# EAGLE board alan2 (EAGLE 7.4.0)
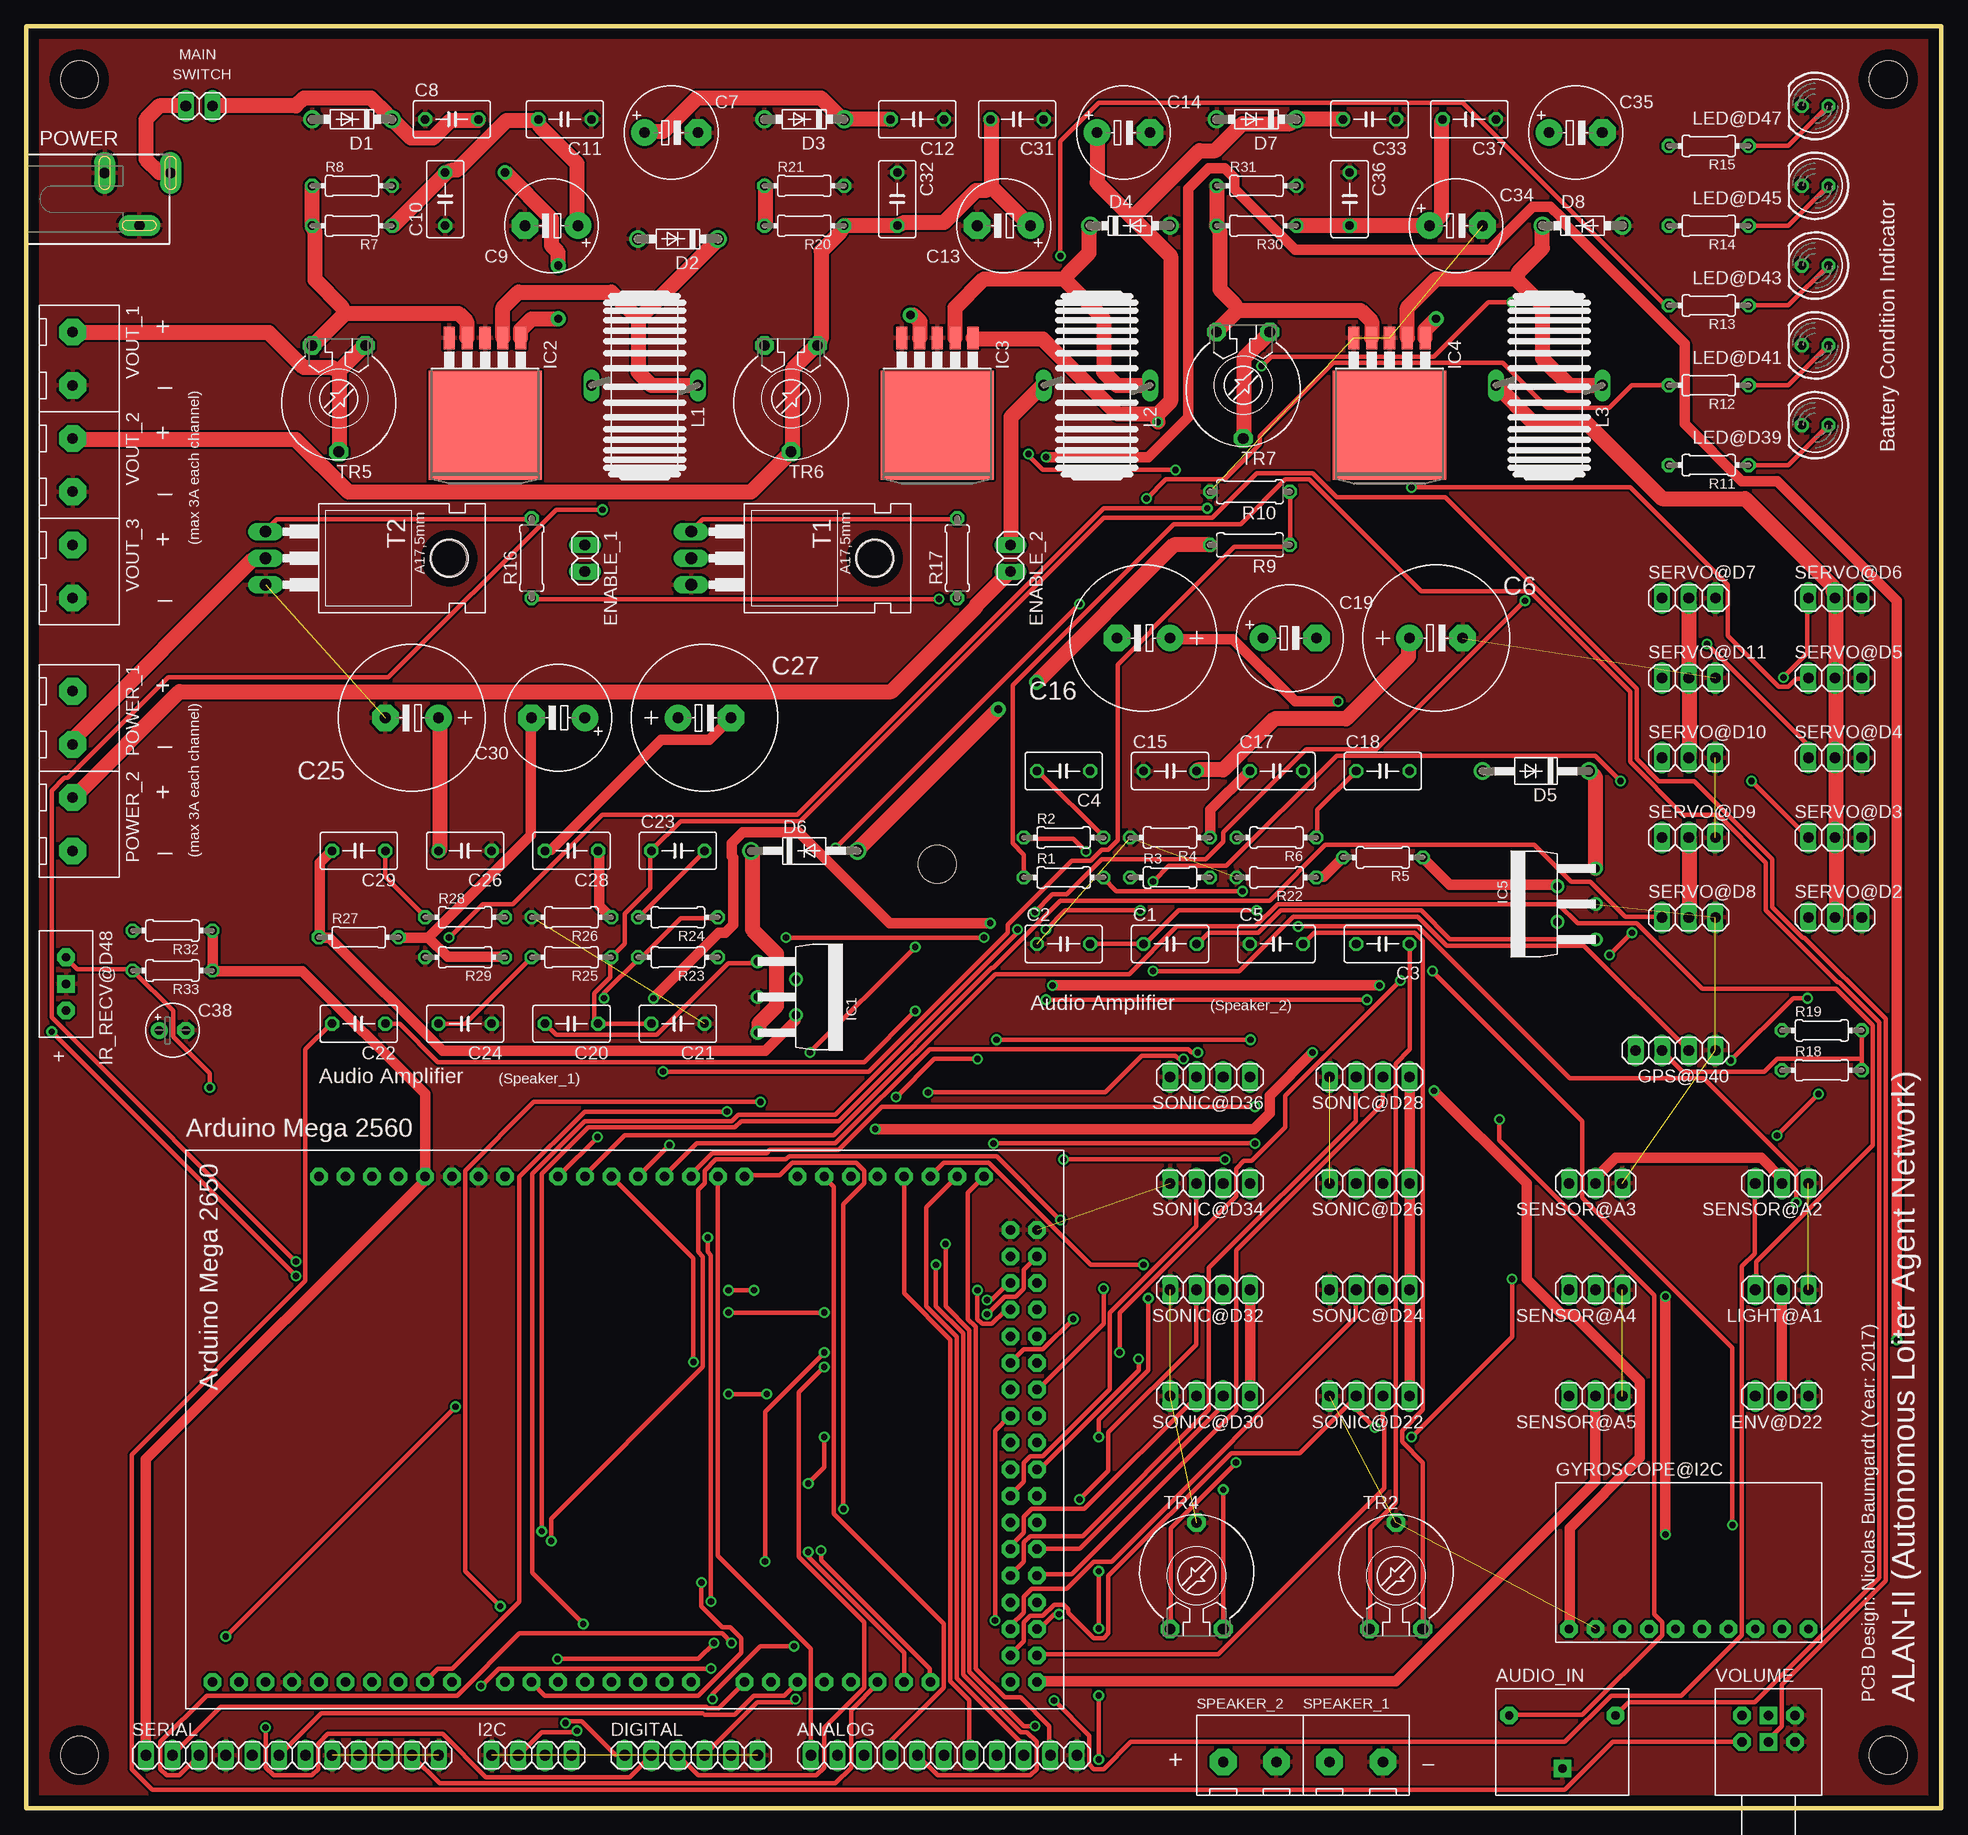
[diagram p5: board, top side]
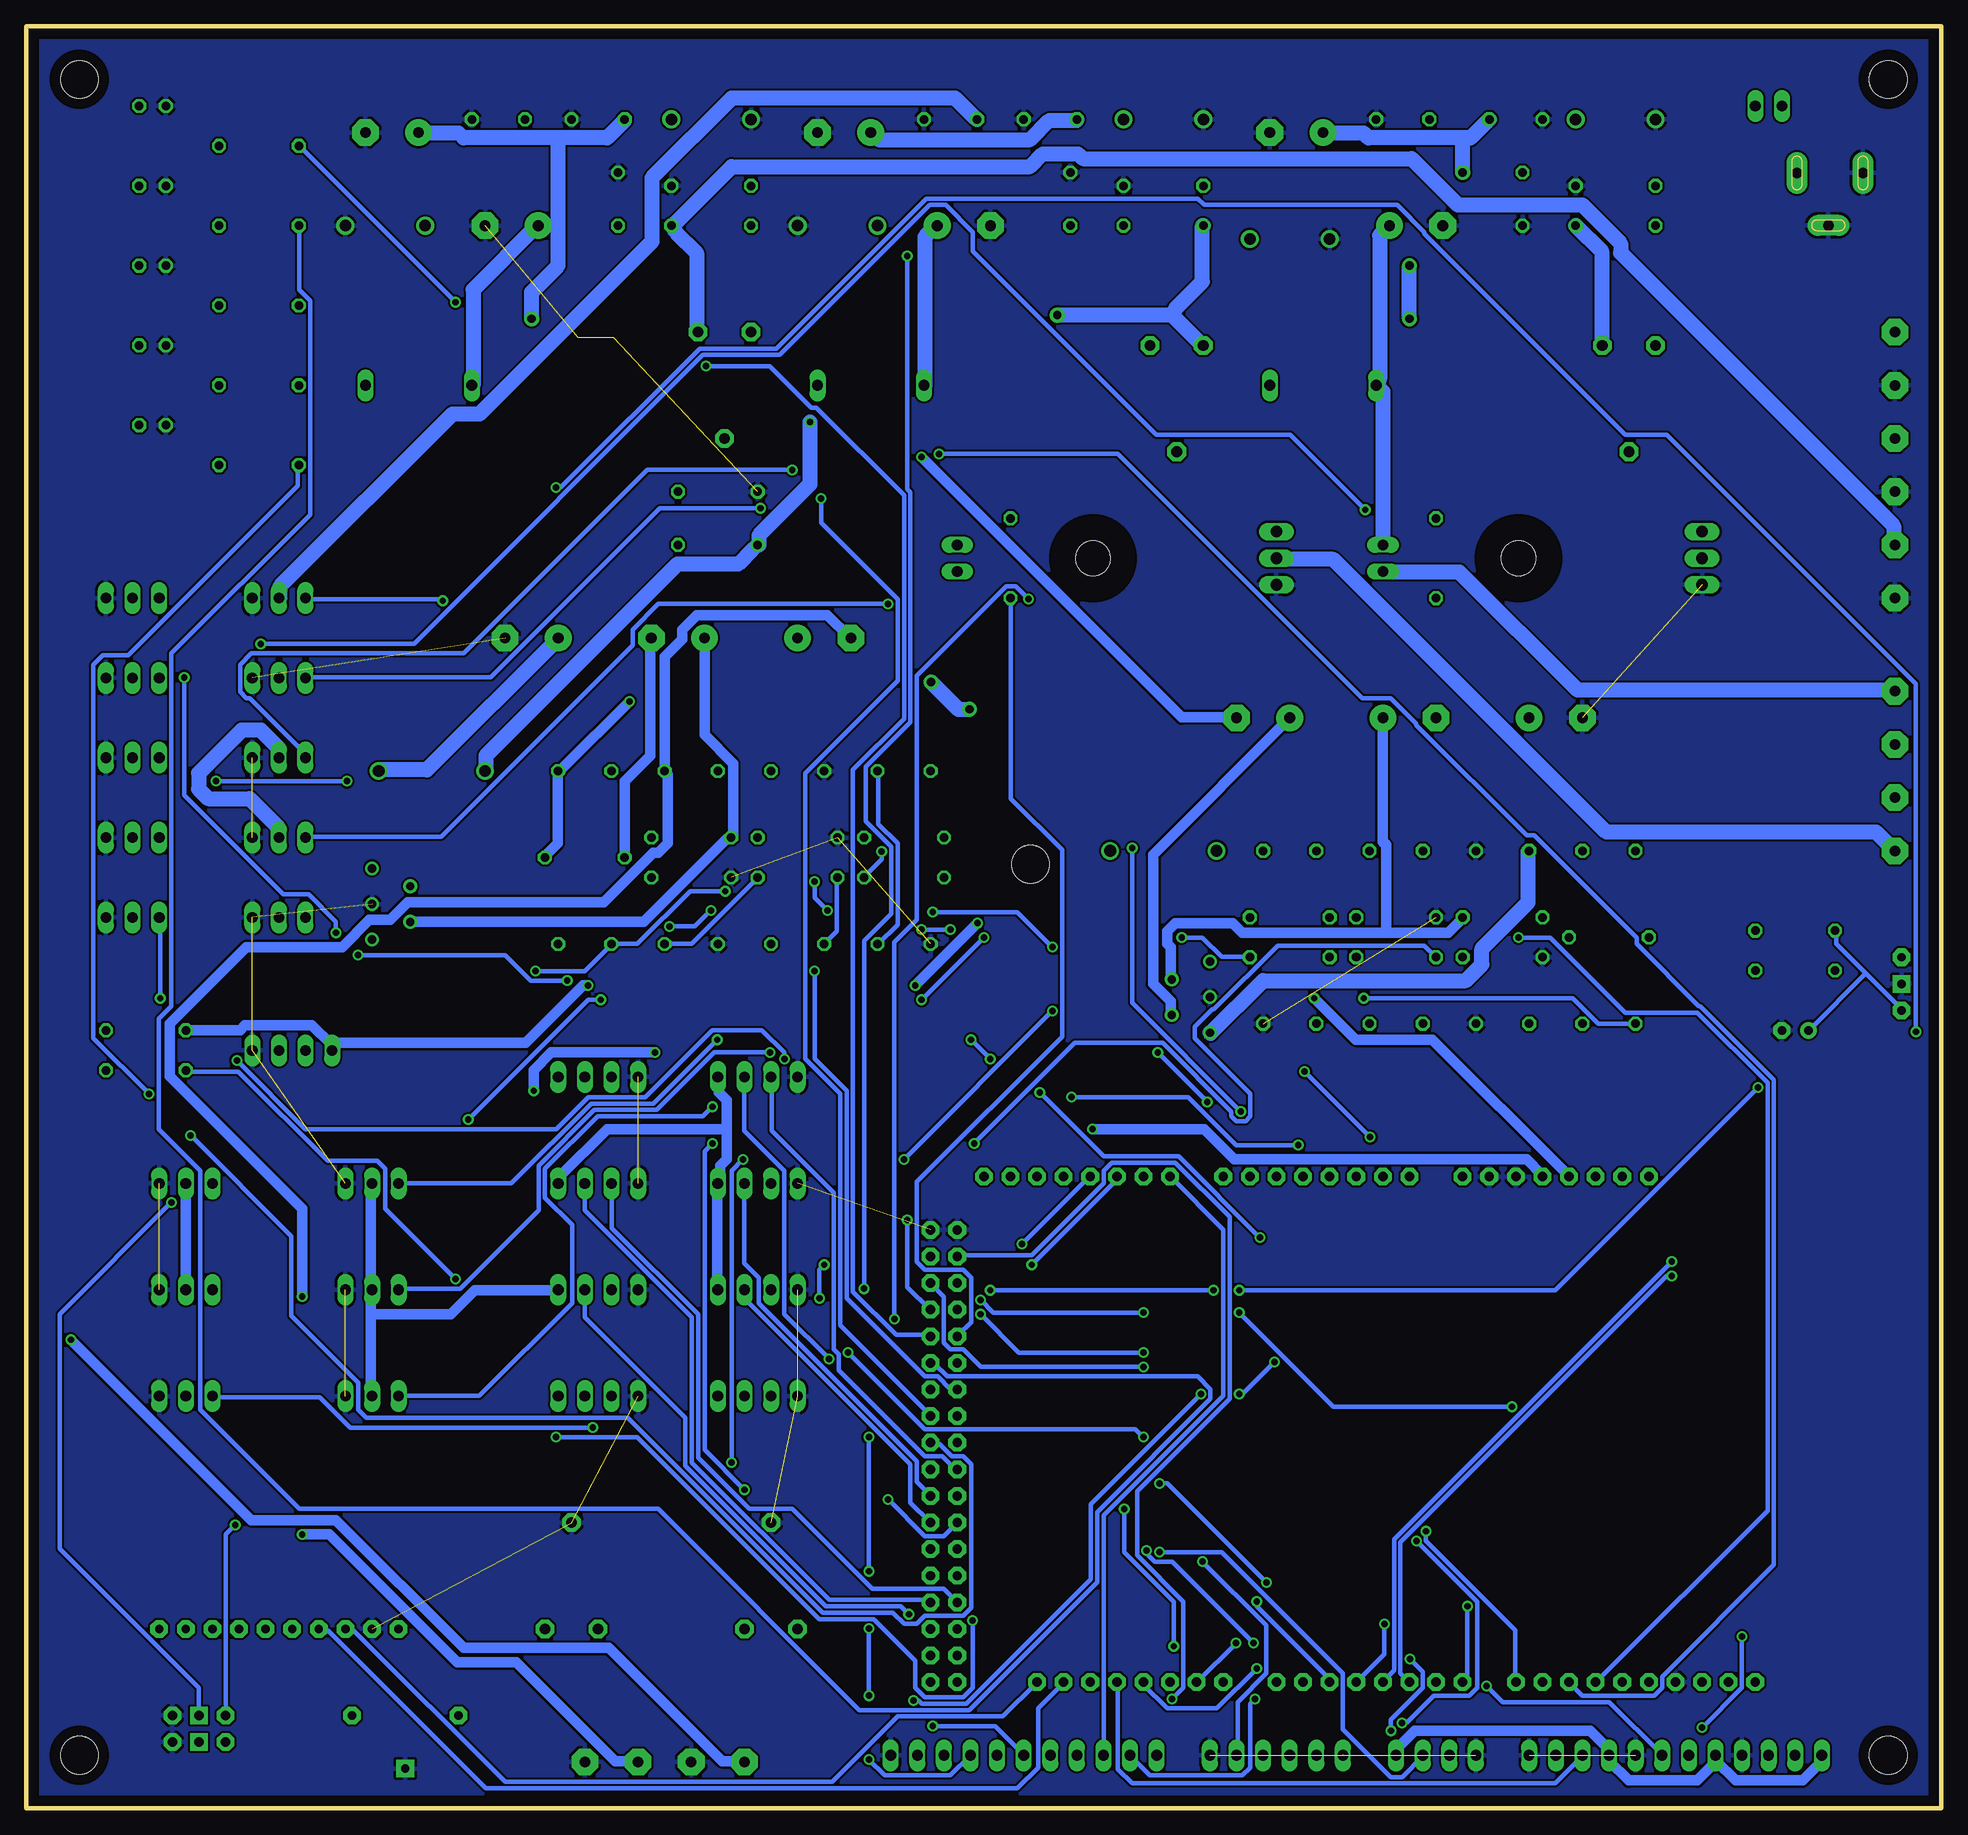
[diagram p6: board, bottom side, seen from below]

Size 182.88 x 170.18 mm. Coordinates in mm from the lower left corner, seen from the top.
Outline: 0,0 0,170.18 182.88,170.18 182.88,0 0,0
Copper layers (1*16): Top 0.035mm / dielectric 1.5mm / Bottom 0.035mm
Design rules "default": minimum track width 10mil, minimum drill 24mil, track to track 8mil, track to pad 8mil, pad to pad 8mil, via to via 8mil, smd to smd 8mil, copper to edge 40mil, drill to drill 8mil, minimum pad ring 10mil, minimum via ring 8mil, stop-mask expansion 4mil, vias tented up to drill 0mil, thermal gap 10mil
Net classes: 0 default: width 0.406 mm, clearance 0.203 mm; 1 lo_power: width 1.016 mm, clearance 0.305 mm; 2 hi_pow: width 1.422 mm, clearance 0.406 mm
Holes 3.6 mm at 5.08,165.1 5.08,5.08 177.8,165.1 177.8,5.08 87,90.17

## Footprints (pad centres in the part's own frame; a part is rotated, then mirrored left to right if it is on the bottom)
1X11 = drill 1.016 long: 1 -12.7,0; 2 -10.16,0; 3 -7.62,0; 4 -5.08,0; 5 -2.54,0; 6 0,0; 7 2.54,0; 8 5.08,0; 9 7.62,0; 10 10.16,0; 11 12.7,0
ARDUINO_MEGA_PINOUT = drill 0.9 pad 1.676 octagon: +3.3V -25.4,-21.59; +5V0 -25.4,-19.05; +5V1 22.86,36.83; +5V2 22.86,39.37; A0 -25.4,-6.35; A1 -25.4,-3.81; A2 -25.4,-1.27; A3 -25.4,1.27; A4 -25.4,3.81; A5 -25.4,6.35; A6 -25.4,8.89; A7 -25.4,11.43; A8 -25.4,16.51; A9 -25.4,19.05; A10 -25.4,21.59; A11 -25.4,24.13; A12 -25.4,26.67; A13 -25.4,29.21; A14 -25.4,31.75; A15 -25.4,34.29; AREF 22.86,-34.29; D2 22.86,1.27; D3 22.86,-1.27; D4 22.86,-3.81; D5 22.86,-6.35; D6 22.86,-8.89; D7 22.86,-11.43; D8 22.86,-16.51; D9 22.86,-19.05; D10 22.86,-21.59; D11 22.86,-24.13; D12 22.86,-26.67; D13 22.86,-29.21; D22 20.32,36.83; D23 20.32,39.37; D24 17.78,36.83; D25 17.78,39.37; D26 15.24,36.83; D27 15.24,39.37; D28 12.7,36.83; D29 12.7,39.37; D30 10.16,36.83; D31 10.16,39.37; D32 7.62,36.83; D33 7.62,39.37; D34 5.08,36.83; D35 5.08,39.37; D36 2.54,36.83; D37 2.54,39.37; D38 0,36.83; D39 0,39.37; D40 -2.54,36.83; D41 -2.54,39.37; D42 -5.08,36.83; D43 -5.08,39.37; D44 -7.62,36.83; D45 -7.62,39.37; D46 -10.16,36.83; D47 -10.16,39.37; D48 -12.7,36.83; D49 -12.7,39.37; D50 -15.24,36.83; D51 -15.24,39.37; D52 -17.78,36.83; D53 -17.78,39.37; GND0 22.86,-31.75; GND1 -25.4,-13.97; GND2 -25.4,-16.51; GND3 -20.32,36.83; GND4 -20.32,39.37; IOREF -25.4,-26.67; N/A -25.4,-29.21; RESET -25.4,-24.13; RX0 22.86,6.35; RX1 22.86,24.13; RX2 22.86,19.05; RX3 22.86,13.97; SCL0 22.86,-39.37; SCL1 22.86,29.21; SDA0 22.86,-36.83; SDA1 22.86,26.67; TX0 22.86,3.81; TX1 22.86,21.59; TX2 22.86,16.51; TX3 22.86,11.43; VIN -25.4,-11.43
AUDIOJACK = drill 0.8 pad 1.676 square: GND 0,2.54 | drill 0.8 pad 1.676 octagon: LEFT -5.08,-2.54; RIGHT 5.08,-2.54
C050-035X075 = drill 0.813 octagon: 1 -2.54,0; 2 2.54,0
E5-13 = drill 1.016 pad 2.54: + -2.54,0 | drill 1.016 pad 2.54 octagon: - 2.54,0
E5-8,5 = drill 1.016 pad 2.54: + -2.54,0 | drill 1.016 pad 2.54 octagon: - 2.54,0
E5-10,5 = drill 1.016 pad 2.54: + -2.54,0 | drill 1.016 pad 2.54 octagon: - 2.54,0
E2,5-5 = drill 0.813 pad 1.6: + -1.27,0 | drill 0.813 pad 1.6 octagon: - 1.27,0
DO41-7.6 = drill 1.1 pad 1.7: A 3.81,0; C -3.81,0
DO41-10 = drill 1.118: A 5.08,0; C -5.08,0
1X06 = drill 1.016 long: 1 -6.35,0; 2 -3.81,0; 3 -1.27,0; 4 1.27,0; 5 3.81,0; 6 6.35,0
1X02 = drill 1.016 long: 1 -1.27,0; 2 1.27,0
1X03 = drill 1.016 long: 1 -2.54,0; 2 0,0; 3 2.54,0
1X04 = drill 1.016 long: 1 -3.81,0; 2 -1.27,0; 3 1.27,0; 4 3.81,0
GYROSCOPE = drill 0.8 pad 1.676 octagon: ADO 7.62,0; ECL 10.16,0; EDA 12.7,0; FSYNC 0,0; GND 20.32,0; INT 5.08,0; NCS 2.54,0; SCL 17.78,0; SDA 15.24,0; VCC 22.86,0
PENTAWATT-V = drill 0.8: 1 -3.4,-3.81; 2 -1.7,-0.16; 3 0,-3.81; 4 1.7,-0.16; 5 3.4,-3.81
TO263-5 = smd 1.067 x 2.159: 1 -3.404,-5.791; 2 -1.702,-5.791; 3 0,-5.791; 4 1.702,-5.791; 5 3.404,-5.791 | smd 10.8 x 10.41: 6 0,2.54
TSOP1838 = drill 0.8 pad 1.676 square: GND 0,0 | drill 0.8 pad 1.676 octagon: SIG -2.54,0; VCC 2.54,0
SFT830D = drill 1.016 long: 1 -5.08,0; 2 5.08,0
LED5MM = drill 0.813 octagon: A -1.27,0; K 1.27,0
SCD-014-A = drill 1 pad 2 long: 1 -2.5,13.8; 2 -2.5,7.5; 3 2.5,10.8
TERMINAL_BLOCK = drill 1 pad 2.54 octagon: A 2.54,3.175; B 7.62,3.175
0204/7 = drill 0.813 octagon: 1 -3.81,0; 2 3.81,0
0207/7 = drill 0.813 octagon: 1 -3.81,0; 2 3.81,0
1X12 = drill 1.016 long: 1 -13.97,0; 2 -11.43,0; 3 -8.89,0; 4 -6.35,0; 5 -3.81,0; 6 -1.27,0; 7 1.27,0; 8 3.81,0; 9 6.35,0; 10 8.89,0; 11 11.43,0; 12 13.97,0
TO220 = drill 1.118 long: 1 -2.54,-6.35; 2 0,-6.35; 3 2.54,-6.35 | hole 3.302: 0,11.176
PT-10 = drill 1.016 pad 1.778 octagon: 1 -2.54,-5.08; 2 2.54,-5.08; 3 0,5.08
POTI_STEREO = drill 0.9 pad 1.676 octagon: LA 2.54,5.08; LB 7.62,5.08; RA 2.54,2.54; RB 7.62,2.54 | drill 0.9 pad 1.676 square: LC 5.08,5.08; RC 5.08,2.54

## Placement (x,y rotation side)
ANALOG  [1X11]  87.63,5.08 0 top
ATMEGA  ARDUINO_MEGA_PINOUT  [ARDUINO_MEGA_PINOUT]  57.15,34.92 270 top
AUDIO_IN  AUDIOJACK  [AUDIOJACK]  146.69,6.35 180 top
C1  220nF  [C050-035X075]  109.22,82.55 0 top
C2  2.2nF  [C050-035X075]  99.06,82.55 0 top
C3  47nF  [C050-035X075]  129.54,82.55 180 top
C4  22nF  [C050-035X075]  99.06,99.06 180 top
C5  150nF  [C050-035X075]  119.38,82.55 0 top
C6  1000uF  [E5-13]  134.62,111.76 0 top
C7  220uF  [E5-8,5]  61.59,160.02 0 top
C8  10uF  [C050-035X075]  40.64,161.29 0 top
C9  220uF  [E5-8,5]  50.16,151.13 180 top
C10  10uF  [C050-035X075]  40.01,153.67 90 top
C11  10uF  [C050-035X075]  51.44,161.29 180 top
C12  10uF  [C050-035X075]  85.09,161.29 180 top
C13  220uF  [E5-8,5]  93.34,151.13 180 top
C14  220uF  [E5-8,5]  104.78,160.02 0 top
C15  100nF  [C050-035X075]  109.22,99.06 0 top
C16  1000uF  [E5-13]  106.68,111.76 180 top
C17  100nF  [C050-035X075]  119.38,99.06 0 top
C18  33nF  [C050-035X075]  129.54,99.06 0 top
C19  470uF  [E5-10,5]  120.65,111.76 0 top
C20  220nF  [C050-035X075]  52.07,74.93 180 top
C21  2.2nF  [C050-035X075]  62.23,74.93 180 top
C22  47nF  [C050-035X075]  31.75,74.93 180 top
C23  22nF  [C050-035X075]  62.23,91.44 0 top
C24  150nF  [C050-035X075]  41.91,74.93 180 top
C25  1000uF  [E5-13]  36.83,104.14 180 top
C26  100nF  [C050-035X075]  41.91,91.44 180 top
C27  1000uF  [E5-13]  64.77,104.14 0 top
C28  100nF  [C050-035X075]  52.07,91.44 180 top
C29  33nF  [C050-035X075]  31.75,91.44 180 top
C30  470uF  [E5-10,5]  50.8,104.14 180 top
C31  10uF  [C050-035X075]  94.61,161.29 180 top
C32  10uF  [C050-035X075]  83.19,153.67 270 top
C33  10uF  [C050-035X075]  128.27,161.29 180 top
C34  220uF  [E5-8,5]  136.53,151.13 0 top
C35  220uF  [E5-8,5]  147.96,160.02 0 top
C36  10uF  [C050-035X075]  126.36,153.67 270 top
C37  10uF  [C050-035X075]  137.79,161.29 180 top
C38  100uF  [E2,5-5]  13.97,74.3 0 top
D1  UF4004  [DO41-7.6]  31.11,161.29 180 top
D2  SR504  [DO41-7.6]  62.23,149.86 180 top
D3  UF4004  [DO41-7.6]  74.3,161.29 180 top
D4  SR504  [DO41-7.6]  105.41,151.13 0 top
D5  1N4936  [DO41-10]  144.15,99.06 180 top
D6  1N4936  [DO41-10]  74.3,91.44 0 top
D7  UF4004  [DO41-7.6]  117.47,161.29 180 top
D8  SR504  [DO41-7.6]  148.59,151.13 0 top
DIGITAL  [1X06]  63.5,5.08 0 top
ENABLE_1  [1X02]  53.34,119.38 270 top
ENABLE_2  [1X02]  93.98,119.38 270 top
ENV@D22  [1X03]  167.64,39.37 180 top
GPS@D40  [1X04]  157.48,72.39 180 top
GYROSCOPE@I2C  GYROSCOPE  [GYROSCOPE]  170.18,17.14 180 top
I2C  [1X04]  48.26,5.08 0 top
IC1  TDA2003  [PENTAWATT-V]  73.66,77.47 270 top
IC2  LM2596S  [TO263-5]  43.81,134.62 180 top
IC3  LM2596S  [TO263-5]  87,134.62 180 top
IC4  LM2596S  [TO263-5]  130.18,134.62 180 top
IC5  TDA2003  [PENTAWATT-V]  146.05,86.36 90 top
IR_RECV@D48  TSOP1838  [TSOP1838]  3.81,78.74 270 top
L1  33uH  [SFT830D]  59.05,135.89 180 top
L2  33uH  [SFT830D]  102.23,135.89 180 top
L3  33uH  [SFT830D]  145.41,135.89 180 top
LED@D39  [LED5MM]  170.81,132.08 180 top
LED@D41  [LED5MM]  170.81,139.7 180 top
LED@D43  [LED5MM]  170.81,147.32 180 top
LED@D45  [LED5MM]  170.81,154.94 180 top
LED@D47  [LED5MM]  170.81,162.56 180 top
LIGHT@A1  [1X03]  167.64,49.53 180 top
MAINSWITCH  [1X02]  16.51,162.56 180 top
POWER  12V / 9A  [SCD-014-A]  0,153.67 270 top
POWER_1  TERMINAL_BLOCK  [TERMINAL_BLOCK]  1.27,109.22 270 top
POWER_2  TERMINAL_BLOCK  [TERMINAL_BLOCK]  1.27,99.06 270 top
R1  5K6?  [0204/7]  99.06,88.9 0 top
R2  47K  [0204/7]  99.06,92.71 0 top
R3  2.7K  [0204/7]  109.22,88.9 0 top
R4  1R  [0204/7]  109.22,92.71 180 top
R5  220R  [0204/7]  129.54,90.81 180 top
R6  39R  [0204/7]  119.38,92.71 180 top
R7  ?  [0204/7]  31.11,151.13 180 top
R8  470R  [0204/7]  31.11,154.94 0 top
R9  1M  [0207/7]  116.84,120.65 180 top
R10  390K  [0207/7]  116.84,125.73 180 top
R11  220R  [0204/7]  160.66,128.27 180 top
R12  220R  [0204/7]  160.66,135.89 180 top
R13  220R  [0204/7]  160.66,143.51 180 top
R14  220R  [0204/7]  160.66,151.13 180 top
R15  220R  [0204/7]  160.66,158.75 180 top
R16  2K2  [0207/7]  48.26,119.38 90 top
R17  2K2  [0207/7]  88.9,119.38 90 top
R18  4K7  [0204/7]  171.45,70.48 0 top
R19  10K  [0204/7]  171.45,74.3 0 top
R20  ?  [0204/7]  74.3,151.13 180 top
R21  470R  [0204/7]  74.3,154.94 0 top
R22  2R2  [0204/7]  119.38,88.9 180 top
R23  5K6?  [0204/7]  62.23,81.28 180 top
R24  47K  [0204/7]  62.23,85.09 180 top
R25  2.7K  [0204/7]  52.07,81.28 180 top
R26  1R  [0204/7]  52.07,85.09 180 top
R27  220R  [0204/7]  31.75,83.19 0 top
R28  39R  [0204/7]  41.91,85.09 0 top
R29  2R2  [0204/7]  41.91,81.28 180 top
R30  ?  [0204/7]  117.47,151.13 180 top
R31  470R  [0204/7]  117.47,154.94 0 top
R32  100R  [0204/7]  13.97,83.82 180 top
R33  20K  [0204/7]  13.97,80.01 180 top
SENSOR@A2  [1X03]  167.64,59.69 180 top
SENSOR@A3  [1X03]  149.86,59.69 180 top
SENSOR@A4  [1X03]  149.86,49.53 180 top
SENSOR@A5  [1X03]  149.86,39.37 180 top
SERIAL  [1X12]  25.4,5.08 180 top
SERVO@D2  [1X03]  172.72,85.09 0 top
SERVO@D3  [1X03]  172.72,92.71 0 top
SERVO@D4  [1X03]  172.72,100.33 0 top
SERVO@D5  [1X03]  172.72,107.95 0 top
SERVO@D6  [1X03]  172.72,115.57 0 top
SERVO@D7  [1X03]  158.75,115.57 0 top
SERVO@D8  [1X03]  158.75,85.09 0 top
SERVO@D9  [1X03]  158.75,92.71 0 top
SERVO@D10  [1X03]  158.75,100.33 0 top
SERVO@D11  [1X03]  158.75,107.95 0 top
SONIC@D22  [1X04]  128.27,39.37 180 top
SONIC@D24  [1X04]  128.27,49.53 180 top
SONIC@D26  [1X04]  128.27,59.69 180 top
SONIC@D28  [1X04]  128.27,69.85 180 top
SONIC@D30  [1X04]  113.03,39.37 180 top
SONIC@D32  [1X04]  113.03,49.53 180 top
SONIC@D34  [1X04]  113.03,59.69 180 top
SONIC@D36  [1X04]  113.03,69.85 180 top
SPEAKER_1  TERMINAL_BLOCK  [TERMINAL_BLOCK]  121.92,1.27 0 top
SPEAKER_2  TERMINAL_BLOCK  [TERMINAL_BLOCK]  111.76,1.27 0 top
T1  BD239  [TO220]  69.85,119.38 270 top
T2  BD239  [TO220]  29.21,119.38 270 top
TR2  100K  [PT-10]  130.81,22.22 0 top
TR4  100K  [PT-10]  111.76,22.22 0 top
TR5  10K  [PT-10]  29.84,134.62 180 top
TR6  10K  [PT-10]  73.03,134.62 180 top
TR7  10K  [PT-10]  116.2,135.89 180 top
U$2  POTI_STEREO  [POTI_STEREO]  171.45,11.43 180 top
VOUT_1  TERMINAL_BLOCK  [TERMINAL_BLOCK]  1.27,143.51 270 top
VOUT_2  TERMINAL_BLOCK  [TERMINAL_BLOCK]  1.27,133.35 270 top
VOUT_3  TERMINAL_BLOCK  [TERMINAL_BLOCK]  1.27,123.19 270 top

## Tracks (layer width: path | path; a pad name or v marks a point on that pad's centre or on a via)
+3.3V  (via drill 0.61)
  Top 1.016: v59.89,77.37 66.14,83.62 66.75,83.62 67.51,84.38 67.51,90.78 67.36,90.93 67.36,92.15 68.43,93.22 73.76,93.22 82.45,84.53 v92.05,84.53 | v129.24,78.59 v97.99,78.59
  Bottom 1.016: R19.1 167.64,74.32 162.46,74.32 162,74.78 155.6,74.78 153.77,72.95 153.77,72.49 GPS@D40.4 153.31,73.1 135.18,73.1 129.69,78.59 v129.24,78.59 | v59.89,77.37 55.93,73.41 48.62,73.41 35.66,60.45 ATMEGA.+3.3V | v97.99,78.59 v92.05,84.53
+5V0  (via drill 0.61)
  Top 1.016: R32.1 17.83,83.77 17.83,80.11 R33.1 18.29,79.96 26.36,79.96 38.1,68.22 ATMEGA.+5V0 37.95,59.84 11.43,33.33 SERIAL.12 | v134.42,68.53 143.26,59.69 143.26,50.55 146.61,47.19 147.68,47.19 154.08,40.79 154.08,33.48 147.37,26.77 147.37,17.17 GYROSCOPE@I2C.VCC | v122.83,72.19 118.72,68.07 118.72,66.4 117.2,64.87 v81.08,64.87
  Bottom 1.016: SERIAL.12 11.43,4.52 13.26,2.69 19.66,2.69 21.49,4.52 21.49,4.98 SERIAL.8 21.79,4.22 23.32,2.69 29.87,2.69 31.7,4.52 31.7,4.98 SERIAL.4 31.7,5.59 33.53,7.42 50.29,7.42 51.97,5.74 51.97,5.13 I2C.4 | v134.42,68.53 134.42,70.51 132.74,72.19 v122.83,72.19 | v81.08,64.87 70.41,64.87 67.51,61.98 39.62,61.98 38.1,60.45 ATMEGA.+5V0
+5V2
  Top 1.016: SONIC@D30.1 116.89,39.42 116.89,49.48 SONIC@D32.1 | SONIC@D22.1 132.13,39.42 132.13,49.48 SONIC@D24.1 132.13,49.94 132.13,59.69 SONIC@D26.1 132.13,60.15 132.13,69.75 SONIC@D28.1 | LIGHT@A1.2 ENV@D22.2 | ATMEGA.+5V2 96.62,12.14 130.76,12.14 149.81,31.19 149.81,39.27 SENSOR@A5.2 | SENSOR@A2.2 167.64,60.15 165.66,62.13 151.79,62.13 149.96,60.3 149.96,59.69 SENSOR@A3.2
  Bottom 1.016: SONIC@D32.1 116.89,49.63 116.89,59.69 SONIC@D34.1 116.59,60.15 116.59,61.37 115.98,61.98 115.98,64.87 | 115.98,64.87 115.98,67.62 116.74,68.38 116.74,69.75 SONIC@D36.1 | 115.98,64.87 127.41,64.87 131.98,60.3 131.98,59.69 SONIC@D26.1 | LIGHT@A1.2 SENSOR@A2.2 | 149.96,47.19 149.96,49.48 SENSOR@A4.2 149.96,49.94 149.96,59.69 SENSOR@A3.2 | 149.96,47.19 149.96,39.42 SENSOR@A5.2 | 149.96,47.19 142.34,47.19 140.06,49.48 132.13,49.48 SONIC@D24.1
+12V  (via drill 0.61, 0.8 pad 1.42)
  Top 1.422: C8.2 43.13,161.19 40.54,161.19 38.86,159.51 36.73,159.51 35.05,161.19 D1.C 34.44,161.8 32.92,163.32 26.52,163.32 25.76,162.56 MAINSWITCH.1 | C33.2 125.73,161.34 121.31,161.34 D7.C 120.7,160.88 116.13,160.88 113.54,158.29 112.01,158.29 105.61,151.89 | C12.2 82.45,161.34 78.18,161.34 D3.C 77.57,161.65 75.89,163.32 64.01,163.32 60.81,160.12 59.13,160.12 C7.+ | 108.05,133.15 104.24,133.15 97.08,140.31 90.53,140.31 IC3.1 | 108.05,133.15 109.27,134.37 109.27,148.23 105.61,151.89 | 105.61,151.89 102.26,155.25 102.26,159.97 C14.+ | v108.05,132.38 108.05,133.15 | v92.81,104.95 79.4,91.54 D6.A | v96.47,107.54 109.58,120.65 R9.2 | IC2.1 47.22,141.2 48.26,142.24 v50.8,142.24 | v50.8,147.32 50.8,148.59 50.16,149.22 50.16,151.76 v45.72,156.21 | IC4.1 133.58,141.2 v134.62,142.24
  Bottom 1.422: 45.72,159.51 44.96,159.51 C8.2 | 45.72,159.51 54.71,159.51 55.17,159.97 58.98,159.97 C7.+ | v108.05,132.38 108.05,126.44 112.93,121.56 112.93,120.65 R9.2 113.54,120.19 114.91,118.82 120.7,118.82 138.99,100.53 138.99,99.16 D5.A | v92.81,104.95 93.88,104.95 v96.47,107.54 | C12.2 82.6,161.19 85.19,161.19 87.02,159.36 101.5,159.36 102.11,159.97 C14.+ | 132.08,159.51 127.41,159.51 125.73,161.19 C33.2 | 132.08,159.51 141.12,159.51 141.58,159.97 145.39,159.97 C35.+ | v50.8,142.24 v50.8,147.32 | v45.72,156.21 45.72,159.51 | v134.62,142.24 134.62,144.78 132.08,147.32 132.08,159.51
A0  (via drill 0.61)
  Top 0.406: R10.1 120.7,125.68 120.7,120.65 R9.1 120.55,120.5 115.37,120.5 107.44,112.57 107.44,112.42 104.24,109.22 104.24,92.46 103.33,91.54 102.72,91.54 101.65,90.48 99.82,90.48 93.73,84.38 93.73,83.62 80.47,70.36 v60.81,70.36 | v54.56,64.11 50.9,60.45 ATMEGA.A0
  Bottom 0.406: v60.81,70.36 v54.56,64.11
A1
  Top 0.406: LIGHT@A1.3 165.2,49.63 165.2,52.22 176.33,63.35 176.33,74.78 172.82,78.28 160.02,78.28 153.77,84.53 148.13,84.53 146.3,86.36 119.48,86.36 117.35,84.23 109.88,84.23 105.31,79.65 92.51,79.65 77.11,64.26 57.15,64.26 53.34,60.45 ATMEGA.A1
A2  (via drill 0.61)
  Top 0.406: v98.15,10.31 101.5,6.96 101.5,4.22 101.96,3.76 102.87,3.76 105.46,6.35 146.91,6.35 151.33,10.77 158.04,10.77 163.83,16.56 163.83,51.77 165.05,52.98 165.05,59.69 SENSOR@A2.3 | v67.06,39.57 v70.71,39.57 | v63.7,42.62 63.7,52.53 55.93,60.3 ATMEGA.A2
  Bottom 0.406: v98.15,10.31 97.69,10.31 97.38,10.01 93.12,10.01 81.23,21.89 81.23,29.06 v70.71,39.57 | v67.06,39.57 66.75,39.57 v63.7,42.62
A3  (via drill 0.61)
  Top 0.406: v92.66,73.41 v116.89,73.41 | v90.83,71.58 86.72,71.58 v83.06,67.92 | v61.42,63.35 58.52,60.45 ATMEGA.A3
  Bottom 0.406: SENSOR@A3.3 136.55,59.69 128.93,67.31 122.99,67.31 v116.89,73.41 | v90.83,71.58 v92.66,73.41 | v83.06,67.92 71.93,67.92 67.36,63.35 v61.42,63.35
A4  (via drill 0.61)
  Top 0.406: v111.86,72.19 111.25,72.19 110.95,72.49 86.26,72.49 77.27,63.5 64.01,63.5 60.96,60.45 ATMEGA.A4
  Bottom 0.406: v111.86,72.19 117.2,72.19 122.68,66.7 128.63,66.7 133.96,61.37 133.96,57.1 141.43,49.63 147.22,49.63 SENSOR@A4.3
A5  (via drill 0.61)
  Top 0.406: v117.35,67.01 81.69,67.01 77.57,62.89 71.02,62.89 70.71,62.59 65.53,62.59 63.4,60.45 ATMEGA.A5
  Bottom 0.406: v117.35,67.01 118.26,66.09 128.32,66.09 133.35,61.06 133.35,58.32 130.76,55.73 130.76,48.26 139.6,39.42 147.22,39.42 SENSOR@A5.3
A6
  Top 0.406: ATMEGA.A6 66.04,24.13 74.93,15.24 ANALOG.1
A7  (via drill 0.61)
  Top 0.406: v65.53,10.46 65.53,10.92 70.1,15.49 v73.3,15.49 | v78.03,28.6 78.03,57.71 80.01,59.69 80.01,60.91 79.25,61.67 73.15,61.67 71.93,60.45 68.58,60.45 ATMEGA.A7
  Bottom 0.406: v65.53,10.46 65.99,10.01 65.99,3.91 66.75,3.15 75.59,3.15 77.42,4.98 ANALOG.2 | v73.3,15.49 73.3,19.76 78.03,24.49 v78.03,28.6
A8
  Bottom 0.406: ANALOG.3 80.01,27.99 68.58,39.42 68.58,55.27 73.61,60.3 ATMEGA.A8
A9
  Top 0.406: ANALOG.4 82.6,5.13 82.6,6.5 87.63,11.53 87.63,17.63 77.11,28.14 77.11,59.38 76.2,60.3 ATMEGA.A9
A10  (via drill 0.61)
  Top 0.406: ANALOG.5 87.02,3.15 95.86,3.15 96.47,3.76 96.47,6.35 95.56,7.26 94.94,7.26 89.46,12.75 89.46,45.36 86.87,47.95 v86.87,51.92
  Bottom 0.406: v86.87,51.92 78.79,59.99 78.79,60.3 ATMEGA.A10
A11  (via drill 0.61)
  Top 0.406: v96.32,7.87 95.25,7.87 90.07,13.06 90.07,45.67 87.78,47.95 v87.78,53.9
  Bottom 0.406: v96.32,7.87 90.37,7.87 87.63,5.13 ANALOG.6 | v87.78,53.9 81.38,60.3 ATMEGA.A11
A12
  Top 0.406: ATMEGA.A12 83.82,49.17 88.24,44.76 88.24,12.14 90.07,10.31 90.07,5.13 ANALOG.7
A13  (via drill 0.61)
  Top 0.406: v102.41,10.77 v102.41,4.67 | v102.41,22.66 v102.41,17.17 | v102.41,35.46 102.41,37.13 107.14,41.86 v107.14,48.72 | v106.68,51.92 101.65,51.92 91.9,61.67 87.63,61.67 86.41,60.45 ATMEGA.A13
  Bottom 0.406: ANALOG.8 94.64,3.15 100.89,3.15 v102.41,4.67 | v102.41,17.17 v102.41,10.77 | v102.41,35.46 v102.41,22.66 | v107.14,48.72 107.14,51.46 v106.68,51.92
A14
  Top 0.406: ANALOG.9 95.25,6.04 88.85,12.45 88.85,45.06 85.95,47.95 85.95,57.4 88.85,60.3 ATMEGA.A14
A15
  Top 0.406: ANALOG.10 97.69,5.13 97.69,7.87 94.94,10.62 93.42,10.62 90.68,13.36 90.68,45.97 89.92,46.74 89.92,58.78 91.44,60.3 ATMEGA.A15
D2  (via drill 0.61)
  Top 0.406: v170.08,77.37 168.71,77.37 v162.76,71.43 | v110.49,71.58 110.03,71.58 109.73,71.88 106.53,71.88 103.02,68.38 v86.11,68.38 | v65.08,54.51 65.08,53.14 65.38,52.83 v65.38,19.76
  Bottom 0.406: v170.08,77.37 170.08,84.99 SERVO@D2.1 | v162.76,71.43 156.21,64.87 132.28,64.87 129.24,67.92 123.75,67.92 117.35,74.32 112.62,74.32 110.49,72.19 v110.49,71.58 | v86.11,68.38 80.01,62.28 72.85,62.28 v65.08,54.51 | v65.38,19.76 65.38,19.3 58.52,12.45 58.52,12.14 ATMEGA.D2
D3  (via drill 0.61)
  Top 0.406: v164.74,98.1 170.08,92.76 SERVO@D3.1 | v152.25,98.1 149.81,100.53 125.12,100.53 114.61,90.02 109.12,90.02 v107.59,88.49 | v106.38,85.75 99.21,85.75 v97.38,83.92 | v94.64,83.92 94.64,83.62 77.27,66.24 67.97,66.24 67.36,65.63 53.34,65.63 48.31,60.6 48.31,22.5 v53.19,17.63
  Bottom 0.406: v152.25,98.1 v164.74,98.1 | v107.59,88.49 107.59,86.97 v106.38,85.75 | v94.64,83.92 v97.38,83.92 | v53.19,17.63 53.19,14.73 55.78,12.14 ATMEGA.D3
D4  (via drill 0.61)
  Top 0.406: v160.48,111.2 170.08,101.6 170.08,100.38 SERVO@D4.1 | v55.02,124 50.6,124 34.59,108 13.56,108 3.96,98.4 3.66,98.4 2.44,97.18 2.44,75.54 v25.76,52.22
  Bottom 0.406: v160.48,111.2 145.85,111.2 118.26,138.79 110.95,138.79 96.62,153.11 95.1,153.11 92.51,150.52 92.51,148.69 74.98,131.17 62.18,131.17 v55.02,124 | v25.76,52.22 52.27,25.7 52.27,13.21 53.34,12.14 ATMEGA.D4
D5  (via drill 0.61)
  Top 0.406: v132.28,126.14 153.16,126.14 162.46,116.84 162.46,111.96 167.34,107.09 168.25,107.09 169.01,107.85 170.08,107.85 SERVO@D5.1 | v25.76,50.85 v2.44,74.17
  Bottom 0.406: v132.28,126.14 131.83,126.14 118.57,139.39 111.25,139.39 96.93,153.72 71.02,153.72 70.41,153.11 51.97,153.11 49.38,150.52 49.38,150.37 30.18,131.17 26.21,131.17 2.44,107.39 v2.44,74.17 | v25.76,50.85 26.21,50.85 51.66,25.4 51.66,12.9 50.9,12.14 ATMEGA.D5
D6  (via drill 0.61)
  Top 0.406: v167.79,108 170.08,110.29 170.08,115.47 SERVO@D6.1 | v151.18,81.48 v153.31,83.62 | v131.22,79.05 120.24,68.07 120.24,65.02 117.04,61.82 116.28,61.82 115.52,61.06 115.52,58.47 104.39,47.35 v104.39,43.54 | v76.2,35.46 76.2,32.56 v74.68,31.04 | v64.47,21.59 64.47,19.3 66.45,17.32 67.21,17.32 68.28,16.26 68.28,14.88 64.16,10.77 49.53,10.77 48.31,11.99 ATMEGA.D6
  Bottom 0.406: v167.79,108 167.79,96.72 158.34,87.27 155.91,87.27 153.31,84.68 v153.31,83.62 | v151.18,81.48 137.16,81.48 134.72,79.05 v131.22,79.05 | v104.39,43.54 97.08,36.22 76.96,36.22 v76.2,35.46 | v74.68,31.04 73.91,31.04 v64.47,21.59
D7  (via drill 0.61)
  Top 0.406: v143.1,115.32 128.93,101.14 122.22,101.14 114.3,93.22 114.3,92.3 112.62,90.63 102.72,90.63 99.36,87.27 97.99,87.27 v96.32,85.6 | v74.83,72.19 v84.89,82.25 | v70.1,67.46 48.46,67.46 41.91,60.91 41.91,22.66 v45.26,19.3
  Bottom 0.406: v143.1,115.32 143.26,115.47 156.21,115.47 SERVO@D7.1 | v96.32,85.6 88.24,85.6 v84.89,82.25 | v70.1,67.46 v74.83,72.19 | v45.26,19.3 45.26,12.6 45.72,12.14 ATMEGA.D7
D8  (via drill 0.61)
  Top 0.406: v49.23,26.47 49.23,60.6 53.65,65.02 67.67,65.02 68.28,65.63 77.57,65.63 92.2,80.26 92.35,80.26 98.75,86.67 118.72,86.67 124.05,92 144.02,92 147.52,88.49 149.35,88.49 152.71,85.14 156.21,85.14 SERVO@D8.1
  Bottom 0.406: v49.23,26.47 49.23,25.55 40.69,17.02 40.69,12.14 ATMEGA.D8
D9  (via drill 0.61)
  Top 0.406: v77.27,91.69 v100.58,115.01 | v66.9,66.55 53.34,66.55 47.09,60.3 47.09,19.76 40.69,13.36 39.32,13.36 38.1,12.14 ATMEGA.D9
  Bottom 0.406: v100.58,115.01 122.53,115.01 124.97,112.57 124.97,111.05 143.26,92.76 156.21,92.76 SERVO@D9.1 | v77.27,91.69 77.27,76.91 v66.9,66.55
D10  (via drill 0.61)
  Top 0.406: v109.73,127.81 97.08,127.81 95.71,129.18 v95.71,129.34
  Bottom 0.406: SERVO@D10.1 156.21,100.69 161.54,106.02 161.85,106.02 162.46,106.63 162.46,109.22 161.39,110.29 141.12,110.29 123.6,127.81 v109.73,127.81 | v95.71,129.34 78.64,129.34 55.32,106.02 52.58,106.02 50.14,103.58 50.14,103.43 39.62,92.91 38.86,92.91 29.11,83.16 29.11,82.55 23.16,76.61 23.01,76.61 16,69.6 16,23.27 26.67,12.6 26.67,11.53 27.43,10.77 34.29,10.77 35.51,11.99 ATMEGA.D10
D11  (via drill 0.61)
  Top 0.406: v112.78,124.16 102.87,124.16 73.61,94.89 55.02,94.89 46.48,86.36 43.59,86.36 v40.39,83.16
  Bottom 0.406: v112.78,124.16 122.38,124.16 138.53,108 156.21,108 SERVO@D11.1 | v40.39,83.16 37.34,83.16 30.18,76 23.32,76 16.61,69.29 16.61,28.45 32.92,12.14 ATMEGA.D11
D22  (via drill 0.61)
  Top 0.406: ATMEGA.D22 94.03,14.73 95.25,15.95 95.25,17.78 95.86,18.39 97.08,18.39 98.15,19.46 99.06,19.46 99.52,19 99.52,18.69 101.96,16.26 102.87,16.26 103.33,16.71 103.33,22.2 115.06,33.93 121.61,33.93 126.95,39.27 SONIC@D22.3 126.49,38.66 v128.78,36.37
  Bottom 0.406: v128.78,36.37 151.94,36.37 154.84,39.27 165.05,39.27 ENV@D22.3
D23
  Top 0.406: SONIC@D22.2 129.54,36.98 129.69,36.83 129.69,30.58 113.84,14.73 96.62,14.73 ATMEGA.D23
D24
  Top 0.406: SONIC@D24.3 126.95,49.48 126.95,46.89 103.63,23.57 101.96,23.57 99.36,20.98 96.01,20.98 95.25,20.22 95.25,18.69 94.03,17.48 94.03,17.17 ATMEGA.D24
D25  (via drill 0.61)
  Top 0.406: v98.6,18.54 98.15,18.54 96.62,17.02 ATMEGA.D25
  Bottom 0.406: SONIC@D24.2 129.54,46.89 119.94,37.29 119.94,32.72 106.53,19.3 99.36,19.3 v98.6,18.54
D26
  Bottom 0.406: SONIC@D26.3 126.95,59.69 126.95,55.42 118.72,47.19 118.72,33.48 113.84,28.6 109.73,28.6 102.11,20.98 95.25,20.98 94.03,19.76 ATMEGA.D26
D27
  Bottom 0.406: SONIC@D26.2 129.54,57.1 119.33,46.89 119.33,33.02 106.22,19.91 96.77,19.91 96.62,19.76 ATMEGA.D27
D28
  Top 0.406: SONIC@D28.3 126.95,69.75 126.95,65.63 112.93,51.61 112.93,38.05 100.89,26.01 95.86,26.01 95.25,25.4 95.25,23.57 94.03,22.35 ATMEGA.D28
D29
  Top 0.406: SONIC@D28.2 129.54,67.31 115.52,53.29 115.52,38.05 99.82,22.35 96.62,22.35 ATMEGA.D29
D30
  Top 0.406: SONIC@D30.3 111.71,39.27 101.04,28.6 96.01,28.6 95.25,27.84 95.25,26.31 94.03,25.09 94.03,24.79 ATMEGA.D30
D31
  Top 0.406: SONIC@D30.2 114.3,38.51 100.58,24.79 96.62,24.79 ATMEGA.D31
D32  (via drill 0.61)
  Top 0.406: v100.58,29.52 103.33,32.26 103.33,35.92 111.71,44.3 111.71,49.48 SONIC@D32.3
  Bottom 0.406: v100.58,29.52 97.08,26.01 95.25,26.01 94.03,27.23 ATMEGA.D32
D33
  Bottom 0.406: SONIC@D32.2 114.3,48.72 98.45,32.87 98.45,29.21 96.62,27.38 ATMEGA.D33
D34
  Top 0.406: SONIC@D34.3 111.71,59.69 111.71,55.57 103.48,47.35 103.48,40.03 97.08,33.63 95.86,33.63 95.25,33.02 95.25,31.19 94.03,29.97 ATMEGA.D34
D35
  Bottom 0.406: SONIC@D34.2 114.3,52.07 112.93,50.7 112.93,48.26 97.84,33.17 97.84,31.19 96.62,29.97 ATMEGA.D35
D36
  Bottom 0.406: SONIC@D36.3 111.71,69.75 111.71,64.72 105.77,58.78 105.77,43.84 105.31,43.38 105.31,41.86 97.08,33.63 95.4,33.63 94.03,32.26 ATMEGA.D36
D37  (via drill 0.61)
  Top 0.406: v106.22,42.93 106.22,41.86 96.62,32.26 ATMEGA.D37
  Bottom 0.406: SONIC@D36.2 114.3,64.72 110.49,60.91 110.49,47.19 v106.22,42.93
D39  (via drill 0.61)
  Top 0.406: v167.18,64.26 v171.15,68.22
  Bottom 0.406: v171.15,68.22 176.48,73.56 176.48,109.22 175.56,110.13 173.13,110.13 156.97,126.29 156.97,128.27 R11.2 | v167.18,64.26 157.58,54.66 157.58,47.04 151.18,40.64 151.18,38.05 150.42,37.29 125.42,37.29 106.83,18.69 100.13,18.69 99.06,17.63 97.84,17.63 97.08,18.39 93.42,18.39 92.66,19.15 92.66,32.87 93.42,33.63 94.49,33.63 95.71,34.85 96.47,34.85 ATMEGA.D39
D40  (via drill 0.61)
  Top 0.406: v141.88,50.55 141.88,45.06 v132.28,35.46 | v92.51,17.93 92.51,36.07 93.88,37.44 ATMEGA.D40
  Bottom 0.406: v141.88,50.55 148.59,57.25 148.59,61.06 149.35,61.82 154.08,61.82 162.61,70.36 167.64,70.36 R18.1 | v132.28,35.46 124.51,35.46 107.14,18.09 101.96,18.09 97.99,14.12 97.99,11.53 97.08,10.62 93.42,10.62 92.51,11.53 v92.51,17.93
D41  (via drill 0.61)
  Top 0.406: R12.2 153.31,135.89 151.18,133.76 145.24,133.76 140.97,138.02 124.82,138.02 117.81,131.01 117.81,130.25 114.45,126.9 108.81,126.9 v106.98,125.07
  Bottom 0.406: v106.98,125.07 106.98,122.78 99.67,115.47 99.67,107.7 108.51,98.86 108.51,71.58 105.16,68.22 105.16,46.13 96.62,37.59 ATMEGA.D41
D42  (via drill 0.61)
  Top 0.406: GPS@D40.2 148.74,82.4 135.64,82.4 132.89,85.14 121.01,85.14 115.82,79.96 v107.59,79.96
  Bottom 0.406: v107.59,79.96 107.59,71.58 104.55,68.53 104.55,48.72 97.08,41.25 95.86,41.25 94.64,40.03 94.03,40.03 ATMEGA.D42
D43  (via drill 0.61)
  Top 0.406: R13.2 156.51,143.51 137.16,162.86 102.41,162.86 98.75,159.21 v98.75,148.23 | v102.87,49.63 102.87,46.28 96.62,40.03 ATMEGA.D43
  Bottom 0.406: v98.75,148.23 98.75,125.98 98.45,125.68 98.45,103.73 102.72,99.47 102.72,94.29 100.28,91.85 100.28,85.45 102.87,82.86 v102.87,49.63
D44  (via drill 0.61)
  Top 0.406: v87.17,115.47 48.31,115.47 R16.1 | v99.97,46.74 97.08,43.84 95.25,43.84 94.03,42.62 ATMEGA.D44
  Bottom 0.406: v87.17,115.47 88.39,116.69 89.31,116.69 97.84,108.15 97.84,84.84 99.97,82.7 v99.97,46.74
D45
  Bottom 0.406: R14.2 156.82,151.13 156.82,145.03 155.75,143.97 155.75,123.55 169.01,110.29 169.01,76.61 170.23,75.39 170.23,64.87 166.27,60.91 166.27,38.05 156.82,28.6 122.53,28.6 103.33,9.4 92.81,9.4 80.62,21.59 80.62,28.3 69.8,39.12 69.8,40.03 71.02,41.25 94.94,41.25 96.16,42.47 96.47,42.47 ATMEGA.D45
D46
  Bottom 0.406: R17.1 88.85,115.47 88.85,96.42 83.97,91.54 83.97,73.71 97.84,59.84 97.84,52.22 97.08,51.46 93.42,51.46 92.66,50.7 92.66,46.43 93.88,45.21 ATMEGA.D46
D47  (via drill 0.61)
  Top 0.406: v141.88,143.81 139.6,143.81 134.42,138.63 118.87,138.63 v117.96,137.72
  Bottom 0.406: v141.88,143.81 156.82,158.75 R15.2 | v117.96,137.72 111.86,137.72 107.9,133.76 107.44,133.76 99.06,125.37 99.06,104.04 103.94,99.16 103.94,49.33 99.82,45.21 96.62,45.21 ATMEGA.D47
D48  (via drill 0.61)
  Top 0.406: IR_RECV@D48.SIG 3.81,81.18 4.88,80.11 10.06,80.11 R33.2 14.02,76.15 14.02,73.71 17.53,70.21 v17.53,68.83 | v90.83,49.48 90.83,46.74 91.29,46.28 92.2,46.28 93.42,47.5 93.88,47.5 ATMEGA.D48 | v67.06,49.48 v69.49,49.48
  Bottom 0.406: v69.49,49.48 v90.83,49.48 | v67.06,49.48 36.88,49.48 v17.53,68.83
D49  (via drill 0.61)  (1 unrouted)
  Top 0.406: 57.15,5.13 56.24,5.13 53.03,8.33 51.66,8.33 v51.51,8.18 | v50.14,25.55 50.14,27.69 64.62,42.16 64.62,52.68 64.16,53.14 64.16,59.08 64.77,59.69 64.77,60.91 65.84,61.98 72.54,61.98 72.85,62.28 92.66,62.28 v98.75,56.19
  Bottom 0.406: v51.51,8.18 51.05,8.18 48.46,10.77 45.11,10.77 44.35,11.53 44.35,19.76 v50.14,25.55 | v98.75,56.19 98.75,49.78 96.62,47.65 ATMEGA.D49
D50  (via drill 0.61)
  Top 0.406: DIGITAL.2 57.61,3 43.89,3 39.78,7.11 28.8,7.11 27.89,6.2 27.89,3.76 27.28,3.15 23.62,3.15 22.86,3.91 v22.86,7.72 | v41,38.35 v19.05,16.41 | v76.2,47.35 v67.06,47.35 | v91.75,48.56 92.2,48.56 93.88,50.24 ATMEGA.D50
  Bottom 0.406: v22.86,7.72 19.05,11.53 v19.05,16.41 | v41,38.35 58.06,38.35 v67.06,47.35 | v76.2,47.35 90.53,47.35 v91.75,48.56
D51  (via drill 0.61)
  Top 0.406: DIGITAL.3 64.16,3.15 75.44,3.15 76.2,3.91 76.2,7.72 80.01,11.53 80.01,17.78 73.76,24.03 73.76,39.73 v76.2,42.16
  Bottom 0.406: v76.2,42.16 91.75,42.16 93.42,43.84 94.64,43.84 95.25,44.45 95.25,48.87 96.47,50.09 ATMEGA.D51
D52  (via drill 0.61)
  Top 0.406: v73.46,10.46 73.15,10.16 69.8,10.16 64.77,5.13 DIGITAL.4
  Bottom 0.406: v73.46,10.46 72.39,11.53 72.39,19.76 76.81,24.18 76.81,30.28 67.97,39.12 67.97,56.49 73.15,61.67 79.25,61.67 80.01,60.91 80.01,59.69 86.87,52.83 93.88,52.83 ATMEGA.D52
D53  (via drill 0.61)
  Top 0.406: v70.56,23.57 70.56,37.9 v76.2,43.54 | v91.75,47.19 93.42,48.87 94.49,48.87 95.25,49.63 95.25,51.46 96.47,52.68 ATMEGA.D53
  Bottom 0.406: v70.56,23.57 64.47,17.48 64.47,12.9 67.21,10.16 67.21,5.13 DIGITAL.5 | v76.2,43.54 88.09,43.54 v91.75,47.19
GND  (22 unrouted)
  pour Bottom: 0,0 182.88,0 182.88,170.18 0,170.18
  pour Top: 0,0 182.88,0 182.88,170.18 0,170.18
N$1
  Top 1.422: MAINSWITCH.2 12.7,162.56 11.43,161.29 11.43,157.48 12.7,156.21 13.76,156.21 POWER.1
N$2  (via drill 0.61)
  Top 0.406: v101.19,91.39 99.97,92.61 95.25,92.61 R2.1 | v116.13,87.58 104.09,87.58 102.87,88.8 R1.2 | v162.92,27.08 162.92,43.99 148.59,58.32 148.59,65.63 v134.26,79.96
  Bottom 0.406: v101.19,91.39 101.19,90.63 102.87,88.95 R1.2 | v116.13,87.58 119.48,87.58 124.51,82.55 C3.2 127.1,82.4 129.54,79.96 v134.26,79.96 | U$2.RB 163.83,26.16 v162.92,27.08
N$3
  Top 1.422: IC5.5 149.81,89.87 149.81,98.55 149.35,99.01 D5.C | C15.2 111.86,99.16 114.3,99.16 119.18,104.04 126.03,104.04 131.98,109.98 131.98,111.66 C6.+
  Bottom 1.422: D5.C 149.2,99.16 144.63,99.16 132.13,111.66 C6.+
N$4
  Top 0.406: IC5.1 149.81,83.01 135.94,83.01 133.2,85.75 119.79,85.75 117.65,83.62 112.93,83.62 111.86,82.55 C1.2
N$5
  Top 0.406: C3.1 132.13,82.55 132.13,72.49 130.76,71.12 130.76,29.21 128.32,26.77 128.32,17.17 TR2.1
N$6
  Top 0.406: C4.2 96.62,99.01 102.87,92.76 R2.2
N$7  (via drill 0.61)
  Top 0.406: C2.2 C1.1 106.83,82.55 110.03,85.75 v117.5,85.75 | v169.01,57.86 169.01,60.91 160.17,69.75 147.37,69.75 132.89,84.23 v121.46,84.23
  Bottom 0.406: C1.1 105.46,83.77 105.46,88.8 R3.1 | C4.1 101.5,99.01 101.5,93.98 99.67,92.15 99.67,84.38 101.5,82.55 C2.2 | v169.01,57.86 179.68,47.19 179.68,24.79 166.42,11.53 166.42,8.94 U$2.RC | v121.46,84.23 119.02,84.23 v117.5,85.75
N$8
  Top 0.406: TR2.2 133.35,33.02 131.37,35 131.37,36.07 133.35,38.05 133.35,82.86 132.59,83.62 122.99,83.62 C5.2
  Bottom 0.406: C5.2 119.33,82.55 113.08,88.8 R3.2
N$9  (via drill 0.61)
  Top 1.016: IC5.4 146.15,88.19 135.94,88.19 133.35,90.78 R5.1 | v125.27,105.72 121.16,105.72 115.21,111.66 109.27,111.66 C16.+
  Bottom 1.016: R5.1 133.35,90.93 132.13,92.15 132.13,99.01 C18.2 131.67,99.31 v125.27,105.72
N$10  (via drill 0.61)
  Top 1.016: v156.51,48.87 v156.51,26.16
  Bottom 1.016: C16.- 104.24,111.81 106.38,113.94 118.87,113.94 120.24,112.57 120.24,111.66 121.92,109.98 C17.2 121.61,98.7 121.61,92.15 122.53,91.24 122.99,91.24 127.71,86.51 146.46,86.51 148.13,84.84 150.11,84.84 152.71,82.25 161.85,82.25 169.16,74.93 169.16,69.9 156.51,57.25 v156.51,48.87 | v156.51,26.16 153.92,26.16 141.73,13.97 136.09,13.97 126.64,4.52 124.51,4.52 SPEAKER_1.A
N$11
  Top 1.016: R4.1 113.08,92.76 113.08,95.35 116.74,99.01 C17.1
N$12
  Top 1.016: R22.1 123.29,88.95 123.9,88.95 125.73,90.78 R5.2
  Bottom 1.016: R5.2 125.73,98.1 123.29,100.53 123.29,111.66 C19.-
N$13
  Top 0.406: C18.1 123.29,95.35 123.29,92.76 R6.1
N$14
  Bottom 1.422: ENABLE_1.2 53.34,118.06 46.02,118.06 34.75,106.78 4.57,106.78 POWER_1.A
N$15
  Bottom 1.016: IC5.2 146.15,84.68 123.9,84.68 115.98,92.61 115.67,92.61 R6.2 115.37,93.07 115.37,99.77 118.11,102.51 C19.+
N$16
  Top 0.406: R1.1 95.25,91.08 94.18,92.15 94.18,107.24 109.58,122.63 115.98,122.63 120.24,126.9 122.53,126.9 133.2,116.23 143.56,116.23 153.16,106.63 153.16,99.92 158.19,94.89 161.54,94.89 166.12,90.32 166.12,85.75 172.97,78.89 173.13,78.89 176.94,75.08 176.94,22.05 165.05,10.16 153.01,10.16 151.79,8.94 AUDIO_IN.LEFT
N$17
  Top 1.422: IC3.2 88.7,143.31 91.44,146.05 99.06,146.05 | 99.06,146.05 102.87,142.24 102.87,137.16 104.14,135.89 L2.1 | D4.C 101.5,151.13 101.5,148.54 99.52,146.56 99.06,146.05
N$18
  Top 1.422: R8.1 27.28,154.94 27.28,151.13 R7.2 27.58,150.52 27.58,145.95 30.18,143.36 30.48,142.75 | 30.48,142.75 41.3,142.75 42.06,141.99 42.06,140.46 IC2.4 | 30.48,142.75 27.43,139.7 TR5.2
N$19
  Top 1.422: IC2.2 45.52,143.31 46.99,144.78 55.88,144.78 58.42,142.24 | 58.42,142.24 58.42,137.16 59.69,135.89 L1.1 | D2.C 65.99,149.76 58.83,142.6 58.42,142.24
N$20
  Top 0.406: R17.2 88.85,123.09 64.62,123.09 63.55,122.02 T1.1
N$21  (via drill 0.8 pad 1.42)
  Top 1.422: R20.2 70.56,151.13 70.56,154.94 R21.1 | v84.43,142.6 84.73,142.6 85.34,141.99 85.34,140.46 IC3.4
  Bottom 1.422: 73.46,142.6 v84.43,142.6 | 73.46,142.6 70.56,139.7 TR6.2 | R20.2 70.56,151.13 70.56,145.8 73.15,143.2 73.46,142.6
N$22
  Top 1.422: ENABLE_2.2 93.88,118.06 90.68,114.86 90.68,114.71 82.6,106.63 14.63,106.63 4.57,96.57 POWER_2.A
N$23  (via drill 0.61)
  Top 0.406: v55.17,77.37 55.17,77.83 58.52,81.18 R23.2 58.67,81.18 62.48,84.99 65.99,84.99 R24.1 | U$2.LB 151.49,6.35 146.91,1.78 12.04,1.78 10.06,3.76 10.06,33.78 26.67,50.39 26.67,72.49 29.11,74.93 C22.2
  Bottom 0.406: C22.2 32.77,74.93 35.2,77.37 v55.17,77.37
N$24
  Top 1.422: IC4.2 131.88,143.31 134.62,146.05 142.24,146.05 | 142.24,146.05 144.78,143.51 144.78,138.43 147.32,135.89 L3.1 | D8.C 144.78,149 142.49,146.71 142.24,146.05
N$25
  Bottom 1.422: T1.2 63.4,119.28 58.06,119.28 32,93.22 6.25,93.22 4.57,91.54 POWER_2.B
N$26
  Top 0.406: R19.2 175.26,71.58 | 175.26,71.58 R18.2 | 175.26,71.58 167.18,71.58 165.96,70.36 158.19,70.36 156.21,72.34 GPS@D40.3
N$27  (via drill 0.61)
  Top 0.406: v91.44,83.16 v72.54,83.16 | v128.02,77.22 v97.38,77.22 | v140.66,65.79 140.66,63.8 155.45,49.02 155.45,18.54 156.21,17.78 156.21,16.56 148.59,8.94 141.73,8.94 AUDIO_IN.RIGHT
  Bottom 0.406: v72.54,83.16 70.56,83.16 68.73,81.33 66.14,81.33 R23.1 | v97.38,77.22 v91.44,83.16 | v128.02,77.22 129.24,77.22 v140.66,65.79
N$28
  Bottom 0.406: 7.24,79.73 3.81,76.3 IR_RECV@D48.VCC | 7.24,79.73 10.06,82.55 10.06,83.77 R32.2 | 7.24,79.73 12.65,74.32 C38.+
N$30
  Top 0.406: R15.1 168.25,158.75 172.06,162.56 LED@D47.A
N$31
  Top 0.406: R14.1 168.25,151.13 172.06,154.94 LED@D45.A
N$32
  Top 0.406: R13.1 168.25,143.51 172.06,147.32 LED@D43.A
N$33
  Top 0.406: R12.1 168.25,135.89 172.06,139.7 LED@D41.A
N$34
  Top 0.406: R11.1 168.25,128.27 172.06,132.08 LED@D39.A
N$37
  Top 0.406: R16.2 48.16,123.09 23.93,123.09 22.86,122.02 T2.1
N$43
  Top 1.422: 113.69,151.13 113.69,154.94 R31.1 | 113.69,151.13 R30.2 | IC4.4 128.47,141.99 127.41,143.05 115.67,143.05 | 115.67,143.05 113.69,141.07 TR7.2 | 113.69,151.13 114,150.52 114,145.03 115.37,143.66 115.67,143.05
N$47
  Top 0.406: C20.2 50.6,73.86 60.2,73.86 67.06,80.72 69.8,80.72 IC1.1
N$48  (via drill 0.61)
  Top 0.406: C22.1 35.66,74.93 39.32,71.27 80.01,71.27 v84.89,76.15 | v114.45,61.98 v99.06,61.98 | v115.52,33.02 109.27,26.77 109.27,17.17 TR4.1
  Bottom 0.406: v99.06,61.98 v84.89,76.15 | v114.45,61.98 115.52,60.91 v115.52,33.02
N$49
  Top 0.406: R24.2 58.52,85.14 64.77,91.39 C23.2
N$50
  Top 0.406: C21.2 C20.1 54.56,75.08 54.25,75.39 54.25,77.83 55.78,79.35 55.78,81.18 R25.1 57.15,82.55 57.15,85.45 59.59,87.88 59.59,91.39 C23.1 59.74,91.54 62.48,94.29 73.91,94.29 102.87,123.24 113.23,123.24 117.5,127.51 122.83,127.51 125.12,125.22 135.48,125.22 153.77,106.93 153.77,100.23 155.91,98.1 159.26,98.1 166.73,90.63 166.73,86.06 169.62,83.16 169.77,83.16 177.55,75.39 177.55,21.74 167.64,11.84 167.64,7.87 166.42,6.66 166.42,6.35 U$2.LC
N$51  (via drill 0.61)
  Top 0.406: C24.2 41.91,74.93 R25.2 | v114.3,30.43 TR4.2 | v92.35,63.5 v117.35,63.5
  Bottom 0.406: v114.3,30.43 118.11,34.24 118.11,62.74 v117.35,63.5 | v92.35,63.5 82.75,73.1 74.37,73.1 67.82,66.55 67.82,66.09 67.36,65.63 66.45,65.63 65.99,66.09 65.99,68.22 71.32,73.56 71.32,74.62 69.65,76.3 69.49,76.3 63.4,82.4 49.38,82.4 R25.2
N$52
  Top 1.422: C26.2 39.47,91.54 39.47,104.04 C25.+ | IC1.5 69.95,74.17 69.95,74.93 71.63,76.61 71.63,81.64 69.34,83.92 69.34,91.39 D6.C
  Bottom 1.422: C26.2 39.47,91.39 39.47,86.51 43.89,82.09 43.89,80.57 45.41,79.05 64.77,79.05 69.8,74.02 IC1.5
N$54
  Top 1.016: C29.2 29.11,91.39 28.04,90.32 28.04,83.31 R27.1 28.5,83.16 28.96,83.16 39.78,72.34 70.56,72.34 73.46,75.23 73.46,75.69 IC1.4
  Bottom 1.016: C27.+ 75.29,91.08 75.29,78.74 73.61,77.06 73.61,75.84 IC1.4
N$55  (via drill 0.61)
  Top 1.016: C27.- 65.23,102.06 60.66,102.06 50.14,91.54 49.53,91.54 C28.2 | v178.61,44.76 178.61,115.32 167.18,126.75 163.83,126.75 158.34,132.23 158.34,139.85 146.61,151.59 146.61,151.89 145.54,152.96 143.87,152.96 139.75,148.84 121.16,148.84 115.37,154.63 115.37,155.7 114.45,156.62 112.93,156.62 110.95,154.63 110.95,132.84 107.14,129.03 v97.38,129.03
  Bottom 1.016: v178.61,44.76 161.39,27.53 153.31,27.53 141.12,15.34 127.25,15.34 116.43,4.52 114.3,4.52 SPEAKER_2.A | v97.38,129.03 72.54,104.19 67.36,104.19 C27.-
N$56
  Top 1.016: C28.1 54.71,91.39 54.71,86.21 55.78,85.14 R26.1
N$99
  Top 1.422: T2.2 22.86,119.28 21.64,119.28 4.57,102.21 4.57,101.6 POWER_1.B
N$100
  Top 1.016: 38.41,83.16 40.23,81.33 45.72,81.33 R29.1 | 38.41,83.16 35.66,83.16 R27.2 | 38.41,83.16 48.16,92.91 48.16,104.04 C30.-
N$101
  Top 0.406: C29.1 34.29,88.95 38.1,85.14 R28.1
N$102
  Bottom 1.016: 53.03,83.62 47.09,83.62 45.72,84.99 R28.2 | 53.03,83.62 66.75,83.62 67.67,84.53 73.15,84.53 73.91,83.77 73.91,82.55 73.61,82.25 73.61,79.2 IC1.2 | C30.+ 53.34,92.3 53.03,92 53.03,83.62
RX1
  Top 0.406: SERIAL.2 36.88,4.98 39.47,2.39 77.27,2.39 78.79,3.91 78.79,9.4 81.38,11.99 ATMEGA.RX1
RX2  (via drill 0.61)
  Top 0.406: v43.43,11.68 45.11,13.36 v65.38,13.36
  Bottom 0.406: v43.43,11.68 41.91,10.16 31.7,10.16 26.67,5.13 SERIAL.6 | v65.38,13.36 69.19,9.55 73.91,9.55 76.2,11.84 ATMEGA.RX2
RX3  (via drill 0.61)
  Top 0.406: v67.36,15.8 66.45,16.71 47.09,16.71 41.15,10.77 17.22,10.77 12.8,6.35 12.8,3.76 13.41,3.15 14.63,3.15 16.46,4.98 SERIAL.10
  Bottom 0.406: v67.36,15.8 71.02,12.14 ATMEGA.RX3
SCL  (via drill 0.61)
  Top 0.406: v52.58,7.42 52.43,7.26 49.23,7.26 47.09,5.13 I2C.2 | v50.75,14.27 64.16,14.27 v65.68,15.8 | v75.89,24.64 75.89,23.72 86.26,13.36 86.26,12.14 ATMEGA.SCL1
  Bottom 0.406: v52.58,7.42 52.58,8.48 49.53,11.53 49.53,13.06 v50.75,14.27 | v65.68,15.8 73.46,23.57 75.13,23.57 75.89,24.33 v75.89,24.64 | GYROSCOPE@I2C.SCL 152.4,17.02 151.64,17.02 137.16,2.54 105.92,2.54 99.67,8.79 89.61,8.79 86.41,11.99 ATMEGA.SCL1
SDA  (via drill 0.61)
  Top 0.406: v74.68,24.49 74.68,24.03 83.82,14.88 ATMEGA.SDA1
  Bottom 0.406: v74.68,24.49 68.73,24.49 57.15,12.9 57.15,7.57 52.58,3 51.51,3 49.53,4.98 I2C.3 | GYROSCOPE@I2C.SDA 154.84,17.02 154.08,17.02 138.99,1.93 88.24,1.93 86.26,3.91 86.26,9.55 83.82,11.99 ATMEGA.SDA1
TX1
  Bottom 0.406: SERIAL.3 34.29,4.98 36.88,2.39 77.27,2.39 78.64,3.76 78.64,11.99 ATMEGA.TX1
TX2
  Top 0.406: SERIAL.7 24.23,5.13 28.19,9.09 64.62,9.09 64.77,8.94 67.67,8.94 69.49,10.77 72.39,10.77 73.61,11.99 ATMEGA.TX2
TX3
  Top 0.406: SERIAL.11 18.59,9.7 64.92,9.7 65.08,9.55 66.14,9.55 68.58,11.99 ATMEGA.TX3
VOUT_3A_1
  Top 1.422: 29.87,137.26 29.87,129.64 TR5.3 | 29.87,137.26 32.31,139.7 TR5.1 | VOUT_1.A 4.57,140.92 23.16,140.92 26.52,137.57 29.26,137.57 29.87,137.26 | 40.08,156.16 35.05,151.13 R7.1 | 40.08,156.16 C10.2 | 48.77,161.19 45.87,161.19 41.15,156.46 40.69,156.46 40.08,156.16 | 48.77,161.19 C11.2 | C9.+ 52.58,151.13 52.58,157.07 49.07,160.58 48.77,161.19
  Bottom 1.422: ENABLE_1.1 53.34,135.28 53.95,135.89 L1.2 53.65,136.5 53.65,150.22 52.73,151.13 C9.+ | TR5.1 32.46,139.7 32.46,148.69 34.9,151.13 R7.1
VOUT_3A_2
  Top 1.422: VOUT_2.A 4.57,130.71 25.76,130.71 30.79,125.68 69.19,125.68 72.54,129.03 TR6.3 73.15,129.64 73.15,137.41 75.44,139.7 TR6.1 75.89,140.31 75.89,148.69 77.72,150.52 R20.1 C32.2 83.82,151.44 87.63,151.44 90.68,154.48 91.59,154.48 92.2,154.79 | SERVO@D8.2 158.8,85.14 158.8,92.61 SERVO@D9.2 | SERVO@D10.2 158.8,100.38 158.8,107.85 SERVO@D11.2 158.8,108.61 158.8,115.47 SERVO@D7.2 | ENABLE_2.1 94.03,120.65 94.03,132.84 97.08,135.89 L2.2 | 92.2,154.79 92.2,161.19 C31.2 | 92.2,154.79 95.86,151.13 C13.+
  Bottom 1.422: SERVO@D9.2 158.8,92.76 158.8,93.68 161.54,96.42 165.51,96.42 166.42,97.33 166.42,98.86 162.31,102.97 160.48,102.97 158.8,101.3 158.8,100.38 SERVO@D10.2 | L2.2 97.08,135.89 97.08,150.06 96.01,151.13 C13.+ | SERVO@D7.2 158.65,115.62 158.65,116.69 142.19,133.15 139.6,133.15 123.14,149.61 123.14,155.7 115.52,163.32 94.18,163.32 92.2,161.34 C31.2
VOUT_3A_3
  Top 1.422: SERVO@D2.2 172.82,85.14 172.82,92.61 SERVO@D3.2 172.82,93.37 172.82,100.23 SERVO@D4.2 172.82,100.99 172.82,107.85 SERVO@D5.2 172.82,108.61 172.82,115.47 SERVO@D6.2 172.52,116.23 172.52,116.69 164.13,125.07 156.21,125.07 148.9,132.38 143.87,132.38 140.36,135.89 L3.2 | TR7.3 116.28,130.86 116.28,138.48 118.72,140.92 TR7.1 | R30.1 C36.2 C34.+ 134.11,151.13 135.18,152.2 135.18,161.19 C37.2
  Bottom 1.422: L3.2 140.21,135.89 140.21,145.03 134.11,151.13 C34.+ | 121.16,151.13 115.52,156.77 87.02,156.77 85.8,157.99 82.45,157.99 81.99,157.53 50.6,157.53 46.18,153.11 34.29,153.11 30.63,149.45 30.63,148.54 4.57,122.48 4.57,120.65 VOUT_3.A | 121.16,151.13 R30.1 | TR7.1 118.87,141.07 118.87,148.54 120.85,150.52 121.16,151.13

## Text on the board
tPlace: + | _ | + | Battery Condition Indicator | _ | + | (max 3A each channel) | _ | + | _ | + | _ | (max 3A each channel) | Audio Amplifier | + | Audio Amplifier | PCB Design: Nicolas Baumgardt (Year: 2017) | ALAN-II (Autonomous Loiter Agent Network) | _ | +
tNames: MAIN | SWITCH | (Speaker_2) | (Speaker_1) | Arduino Mega 2560 | VOLUME